# EAGLE design DecadeCounterViewer (EAGLE 7.7.0)
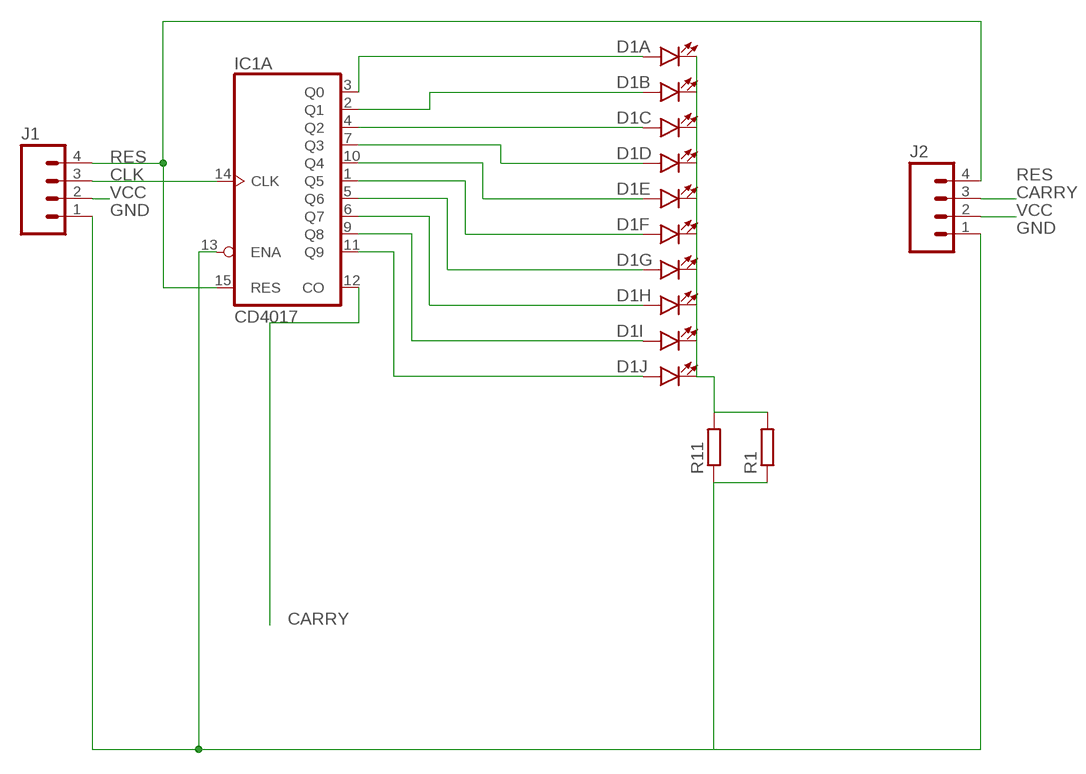
[diagram p0: schematic, sheet 1]

## Parts
D1  LED_BARGRAPH_10  [LED_BARGAPH_10]
IC1  CD4017  [DIL16]
J1  M04LOCK  [1X04_LOCK]
J2  M04LOCK  [1X04_LOCK]
R1  R-EU_0204/7  [0204/7]
R11  R-EU_R1206  [R1206]

## Nets
CARRY: IC1.12(A:CO) J2.3
CLK: IC1.14(A:CLK) J1.3
GND: IC1.13(A:ENA) J1.1 J2.1 R1.1 R11.1
N$2: D1.11(J:C) D1.12(I:C) D1.13(H:C) D1.14(G:C) D1.15(F:C) D1.16(E:C) D1.17(D:C) D1.18(C:C) D1.19(B:C) D1.20(A:C) R1.2 R11.2
N$13: D1.1(A:A) IC1.3(A:Q0)
N$14: D1.2(B:A) IC1.2(A:Q1)
N$15: D1.3(C:A) IC1.4(A:Q2)
N$16: D1.4(D:A) IC1.7(A:Q3)
N$17: D1.5(E:A) IC1.10(A:Q4)
N$18: D1.6(F:A) IC1.1(A:Q5)
N$19: D1.7(G:A) IC1.5(A:Q6)
N$20: D1.8(H:A) IC1.6(A:Q7)
N$21: D1.9(I:A) IC1.9(A:Q8)
N$22: D1.10(J:A) IC1.11(A:Q9)
RES: IC1.15(A:RES) J1.4 J2.4
VCC: J1.2 J2.2

## Power pins joined to a net without a drawn wire
GND: IC1.8(P:GND)
VCC: IC1.16(P:VCC)

## Library data of the parts
D1 = SparkFun-LED:LED_BARGRAPH_10: 10-Segment LED Bar Graph SFE part numbers: COM-09935 (red, Vf = 2.1V, Ifmax = 20mA) COM-09936 (yellow, Vf = 2.1V, Ifmax = 20mA) COM-09937 (blue, Vf = 3.4V, Ifmax = 20mA) COM-09938 (green, Vf = 3.4V, Ifmax = 20mA)
IC1 = SparkFun-DigitalIC:CD4017; PROD_ID: IC-11929
J1 J2 = SparkFun-Connectors:M04: Header 4 Standard 4-pin 0.1" header. Use with straight break away headers (SKU : PRT-00116), right angle break away headers (PRT-00553), swiss pins (PRT-00743), machine pins (PRT-00117), and female headers (PRT-00115). Molex polarized connector foot print use with SKU : PRT-08231 with associated crimp pins and housings. 1MM SMD Version SKU: PRT-10208; PROD_ID: CONN-09696
R1 R11 = resistor:R-EU_: RESISTOR, European symbol

## Board
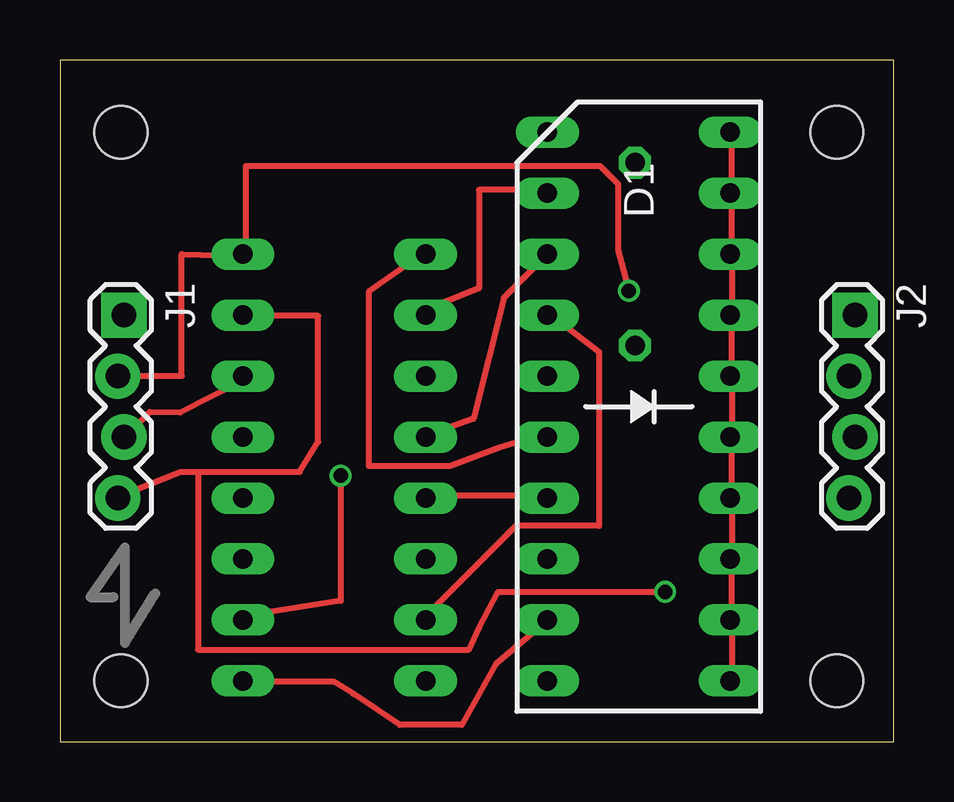
[diagram p1: board, top side]
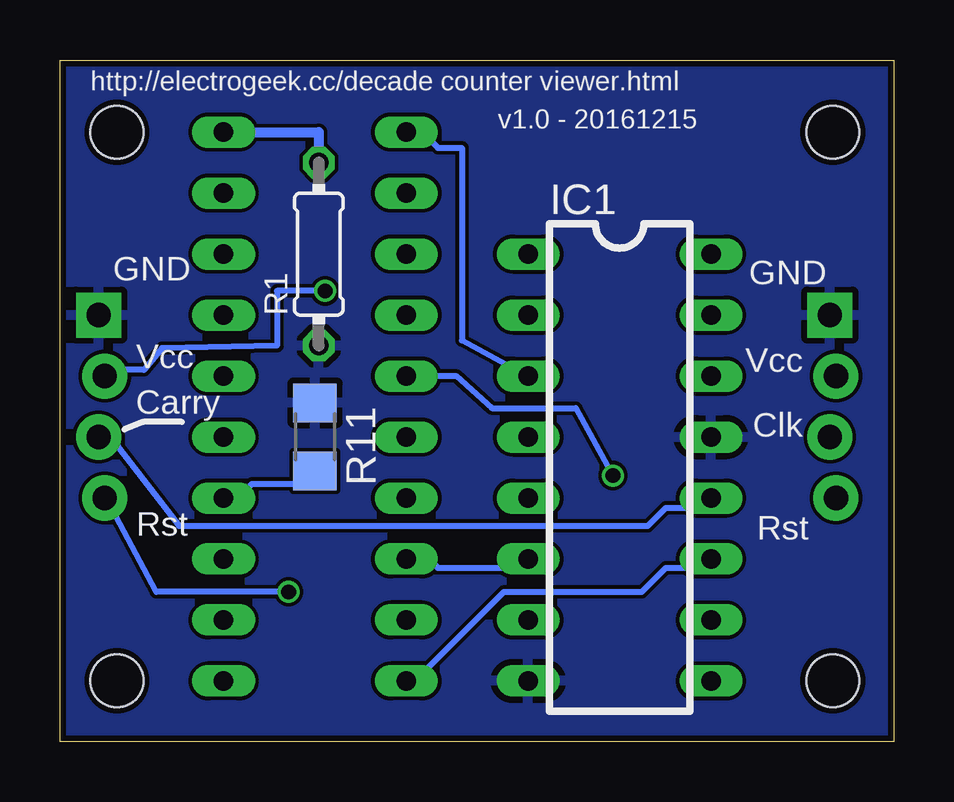
[diagram p2: board, bottom side, seen from below]

Size 34.76 x 28.41 mm. Coordinates in mm from the lower left corner, seen from the top.
Outline: 0,0 34.76,0 34.76,28.41 0,28.41 0,0
Copper layers (1*16): Top 0.035mm / dielectric 1.5mm / Bottom 0.035mm
Design rules "SeeedStudio_2layer_DRU_no_angle_20140221": minimum track width 6mil, minimum drill 12mil, track to track 6mil, track to pad 6mil, pad to pad 6mil, via to via 6mil, smd to smd 0mil, copper to edge 10mil, drill to drill 10mil, minimum pad ring 10mil, minimum via ring 6mil, stop-mask expansion 2mil, vias tented up to drill 100mil, thermal gap 10mil
Holes 2.2 mm at 32.38,25.4 2.54,25.4 2.54,2.54 32.38,2.54

### Footprints (pad centres in the part's own frame; a part is rotated, then mirrored left to right if it is on the bottom)
LED_BARGAPH_10 = drill 0.813 long: 1 -11.43,-3.81; 2 -8.89,-3.81; 3 -6.35,-3.81; 4 -3.81,-3.81; 5 -1.27,-3.81; 6 1.27,-3.81; 7 3.81,-3.81; 8 6.35,-3.81; 9 8.89,-3.81; 10 11.43,-3.81; 11 11.43,3.81; 12 8.89,3.81; 13 6.35,3.81; 14 3.81,3.81; 15 1.27,3.81; 16 -1.27,3.81; 17 -3.81,3.81; 18 -6.35,3.81; 19 -8.89,3.81; 20 -11.43,3.81
DIL16 = drill 0.813 long: 1 -8.89,-3.81; 2 -6.35,-3.81; 3 -3.81,-3.81; 4 -1.27,-3.81; 5 1.27,-3.81; 6 3.81,-3.81; 7 6.35,-3.81; 8 8.89,-3.81; 9 8.89,3.81; 10 6.35,3.81; 11 3.81,3.81; 12 1.27,3.81; 13 -1.27,3.81; 14 -3.81,3.81; 15 -6.35,3.81; 16 -8.89,3.81
1X04_LOCK = drill 1.016 pad 1.88 square: 1 0,0.127 | drill 1.016 pad 1.88: 2 2.54,-0.127; 3 5.08,0.127; 4 7.62,-0.127
0204/7 = drill 0.813 octagon: 1 -3.81,0; 2 3.81,0
R1206 = smd 1.6 x 1.803: 1 -1.422,0; 2 1.422,0

### Placement (x,y rotation side)
D1  24.13,13.97 270 top
IC1  11.43,11.43 270 bottom
J1  2.54,17.78 270 top
J2  33.02,17.78 270 top
R1  23.97,20.32 90 bottom
R11  24.13,12.7 270 bottom

### Tracks (layer width: path | path; a pad name or v marks a point on that pad's centre or on a via)
CARRY
  Bottom 0.254: IC1.12 7.75,10 8,9.75 9.5,9.75 10.25,9 29.79,9 32.5,12.5 33,12.5 J2.3
CLK
  Top 0.254: IC1.14 7.5,15 5.02,13.73 3.75,13.75 2.75,12.75 J1.3
GND
  pour Bottom: -1.27,30.48 40.64,30.48 40.64,-1.27 -1.27,-1.27
N$2
  Top 0.254: D1.20 28,25.25 28,23 D1.19 28,22.75 28,20.5 D1.18 28,20.25 28,18 D1.17 28,17.75 28,15.25 D1.16 28,15 28,12.75 D1.15 28,12.5 28,10.25 D1.14 28,10 28,7.75 D1.13 28,7.5 28,5.25 D1.12 28,5 28,2.75 D1.11
  Bottom 0.254: R11.2 24.25,11.25 24.75,10.75 26.75,10.75 27.25,10.25 27.75,10.25 D1.14
  Bottom 0.406: D1.20 23.97,25.4 R1.2
N$13
  Bottom 0.254: IC1.3 18,16.73 18,24.75 19,24.75 19.5,25.25 20.25,25.25 D1.1
N$14
  Top 0.254: IC1.2 15.25,18 17.46,18.89 17.46,23 20.25,23 D1.2
N$15
  Top 0.254: D1.3 18.5,18.5 17.23,13.46 15.25,12.75 IC1.4
N$16
  Top 0.254: IC1.7 15.25,5.25 19,9 22.48,9 22.48,16.25 20.5,17.75 D1.4
N$17  (via drill 0.61)
  Top 0.254: v11.71,11.1 11.71,5.87 7.75,5.25 IC1.10
  Bottom 0.254: v11.71,11.1 13.25,13.91 16.75,13.91 18.25,15.25 20.25,15.25 D1.5
N$18
  Top 0.254: D1.6 20.25,12.5 19.06,12.5 18.27,12.25 16.25,11.5 12.87,11.5 12.87,18.75 15,20.25 IC1.1
N$19
  Top 0.254: IC1.5 15.25,10.25 20.25,10.25 D1.7
N$20
  Bottom 0.254: IC1.6 15.25,7.5 15.5,7.25 19,7.25 19.25,7.5 20.25,7.5 D1.8
N$21
  Top 0.254: IC1.9 7.75,2.5 11.44,2.5 12.23,2 14.16,0.71 16.75,0.71 18.18,3.25 20.25,5 D1.9
N$22
  Bottom 0.254: IC1.11 7.75,7.5 8,7.25 9.5,7.25 10.5,6.25 16.25,6.25 19.75,2.75 20.25,2.75 D1.10
RES  (via drill 0.61)
  Top 0.254: 5.75,11.25 5.04,11.25 2.5,10.25 J1.4 | 5.75,11.25 10,11.25 10.77,12.5 10.77,17.75 7.75,17.75 IC1.15 | v25.23,6.25 18.27,6.25 17.48,4.75 17.04,3.84 5.75,3.84 5.75,11.25
  Bottom 0.254: v25.23,6.25 30.75,6.25 32.75,10 J2.4
VCC  (via drill 0.61)
  Top 0.254: J1.2 2.5,15.25 5.08,15.25 5.08,20.32 7.5,20.25 IC1.16 7.75,20.5 7.75,24 22.52,24 23.27,23.25 23.27,20.5 v23.71,18.79
  Bottom 0.254: v23.71,18.79 25.72,18.79 25.72,16.51 30.5,16.41 31.25,15.5 32.5,15.5 32.75,15.25 J2.2

### Text on the board
bNames: http://electrogeek.cc/decade counter viewer.html | v1.0 - 20161215 | GND | GND | Vcc | Vcc | Carry | Clk | Rst | Rst